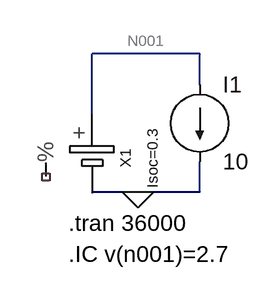
[diagram p0: schematic Li-Ion-Example.asc]
Li-Ion-Example.asc, the LTspice schematic file:
Version 4.1
SHEET 1 880 680
WIRE 288 64 176 64
WIRE 288 96 288 64
WIRE 176 128 176 64
WIRE 224 208 176 208
WIRE 288 208 288 176
WIRE 288 208 224 208
FLAG 224 208 0
SYMBOL Circuitos\ Lineales\\SE-531454\\Li-Ion 48 176 R0
WINDOW 39 191 -3 VCenter 1
SYMATTR InstName X1
SYMATTR SpiceLine Isoc=0.3
SYMBOL current 288 96 R0
WINDOW 123 0 0 Left 0
WINDOW 39 0 0 Left 0
SYMATTR InstName I1
SYMATTR Value 10
TEXT 152 240 Left 2 !.tran 36000
TEXT 152 272 Left 2 !.IC v(n001)=2.7

The netlist it stands for:
* Li-Ion-Example.asc
X§X1 N001 0 NC_01 Li-Ion Isoc=0.3  ; pins cell+ cell- V.soc
I1 N001 0 10
.tran 36000
.IC v(n001)=2.7
.backanno
.end